# EAGLE design OPA340 (EAGLE 5.11)
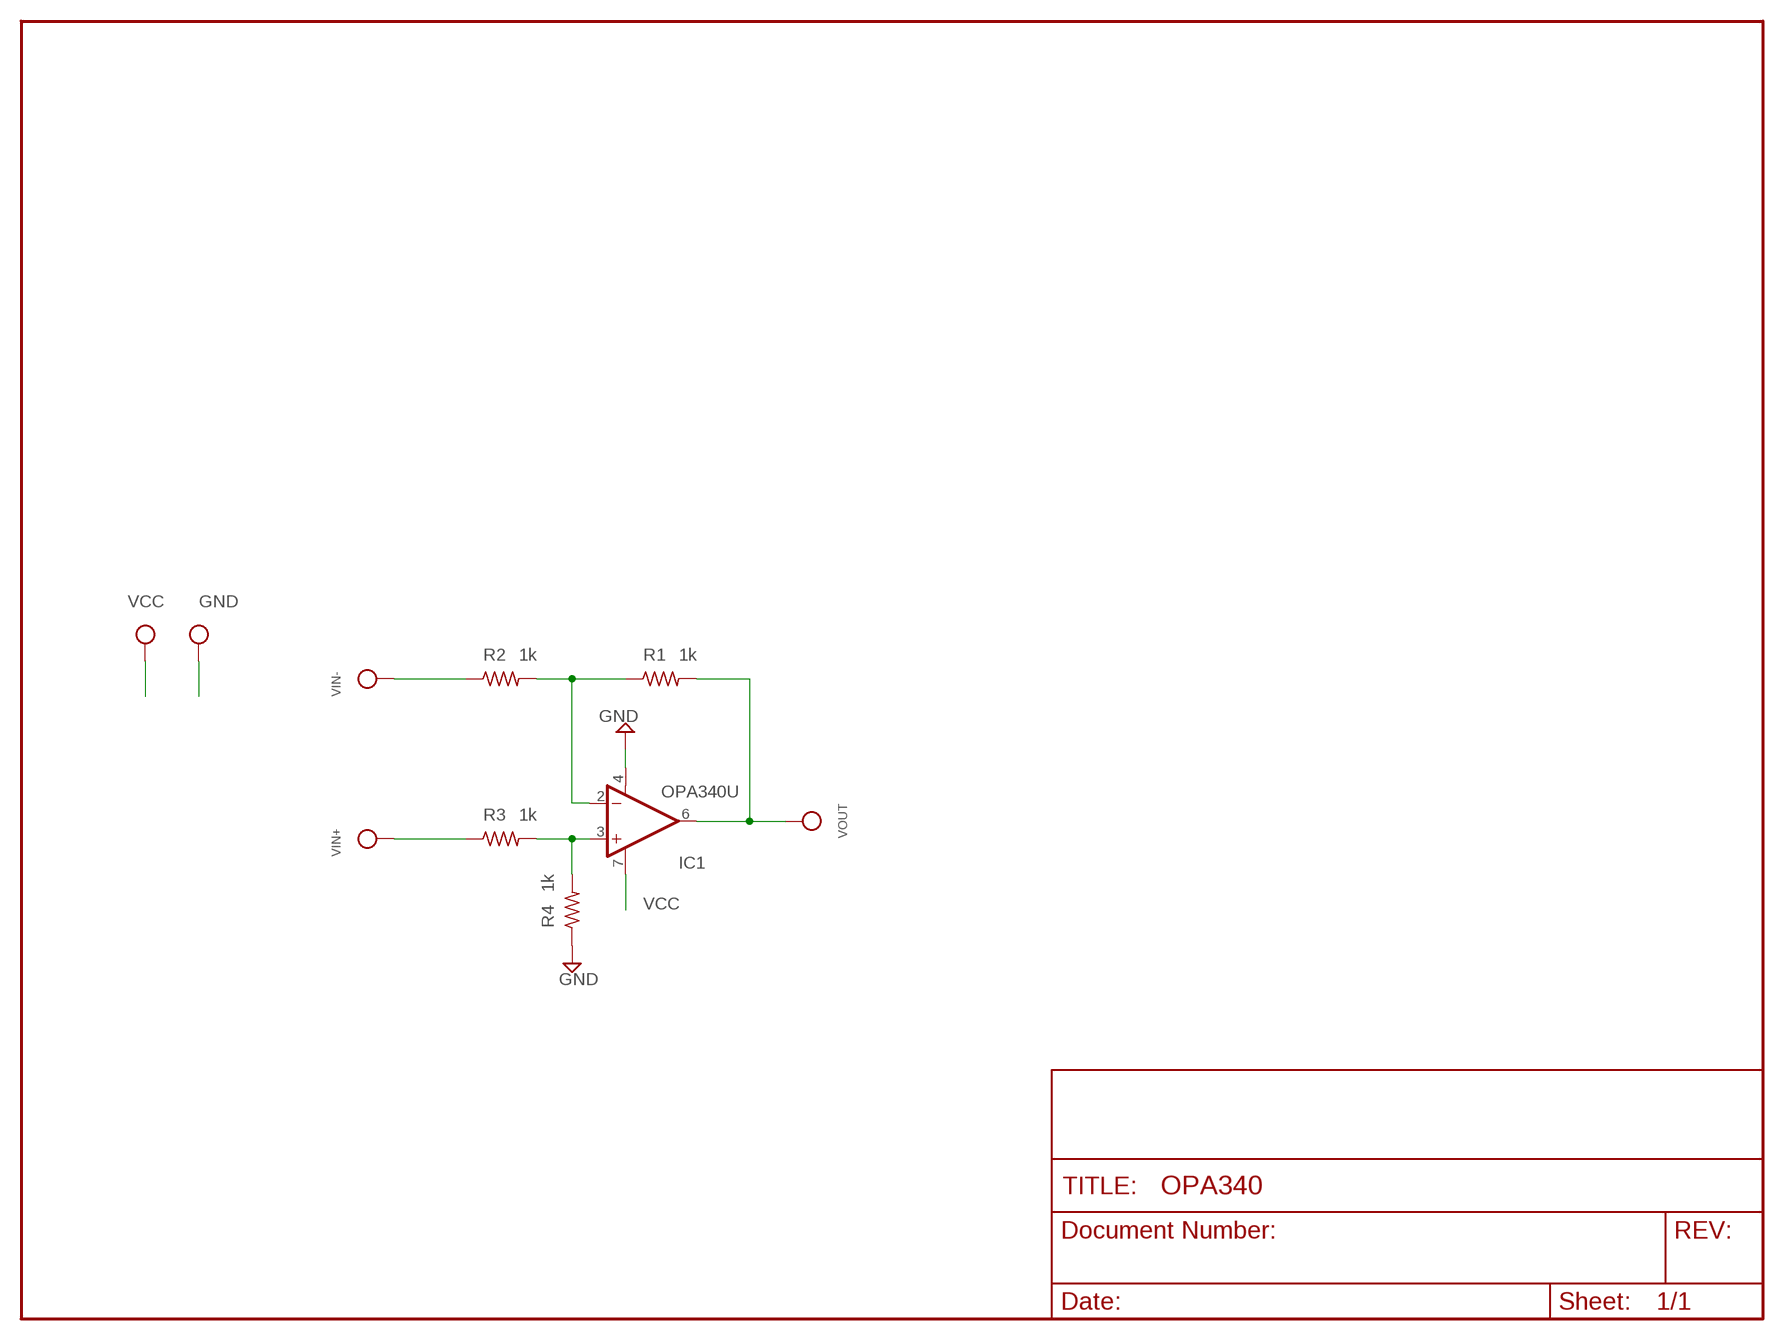
[diagram p0: schematic, sheet 1]

## Parts
IC1  OPA340U  [SO08]
R1  1k  R-US_R0805  [R0805]
R2  1k  R-US_R0805  [R0805]
R3  1k  R-US_R0805  [R0805]
R4  1k  R-US_R0805  [R0805]
TP1  TESTPOINTPAD  [TESTPOINT_PAD_2MM]
VCC  TESTPOINTPAD  [TESTPOINT_PAD_2MM]
VIN+  TESTPOINTPAD  [TESTPOINT_PAD_2MM]
VIN-  TESTPOINTPAD  [TESTPOINT_PAD_2MM]
VOUT  TESTPOINTPAD  [TESTPOINT_PAD_2MM]

## Nets
GND: IC1.4(V-) R4.1 TP1.P$1
N$1: R3.1 VIN+.P$1
N$2: R2.1 VIN-.P$1
N$3: IC1.2(-IN) R1.1 R2.2
N$4: IC1.3(+IN) R3.2 R4.2
N$5: IC1.6(OUT) R1.2 VOUT.P$1
VCC: IC1.7(V+) VCC.P$1

## Library data of the parts
IC1 = burr-brown:OPA340: Rail-to-Rail Operational Amplifiers Single-Supply, MicroAmplifier(TM) Series; MPN: OPA340UA; OC_FARNELL: 1106196; OC_NEWARK: 24M5449
R1-R4 = resistor:R-US_: RESISTOR, American symbol
TP1 VCC VIN+ VIN- VOUT = microbuilder:TESTPOINT: Test Point TESTPOINT_SMT - Compact Surface Mount Test Point [Digikey: 5016KTR-ND] TESTPOINT_PAD - Square Pad (2mm) TESTPOINT_SMT - Round Pad (2mm) TESTPOINT_0.1" - 0.1" Header

## Board
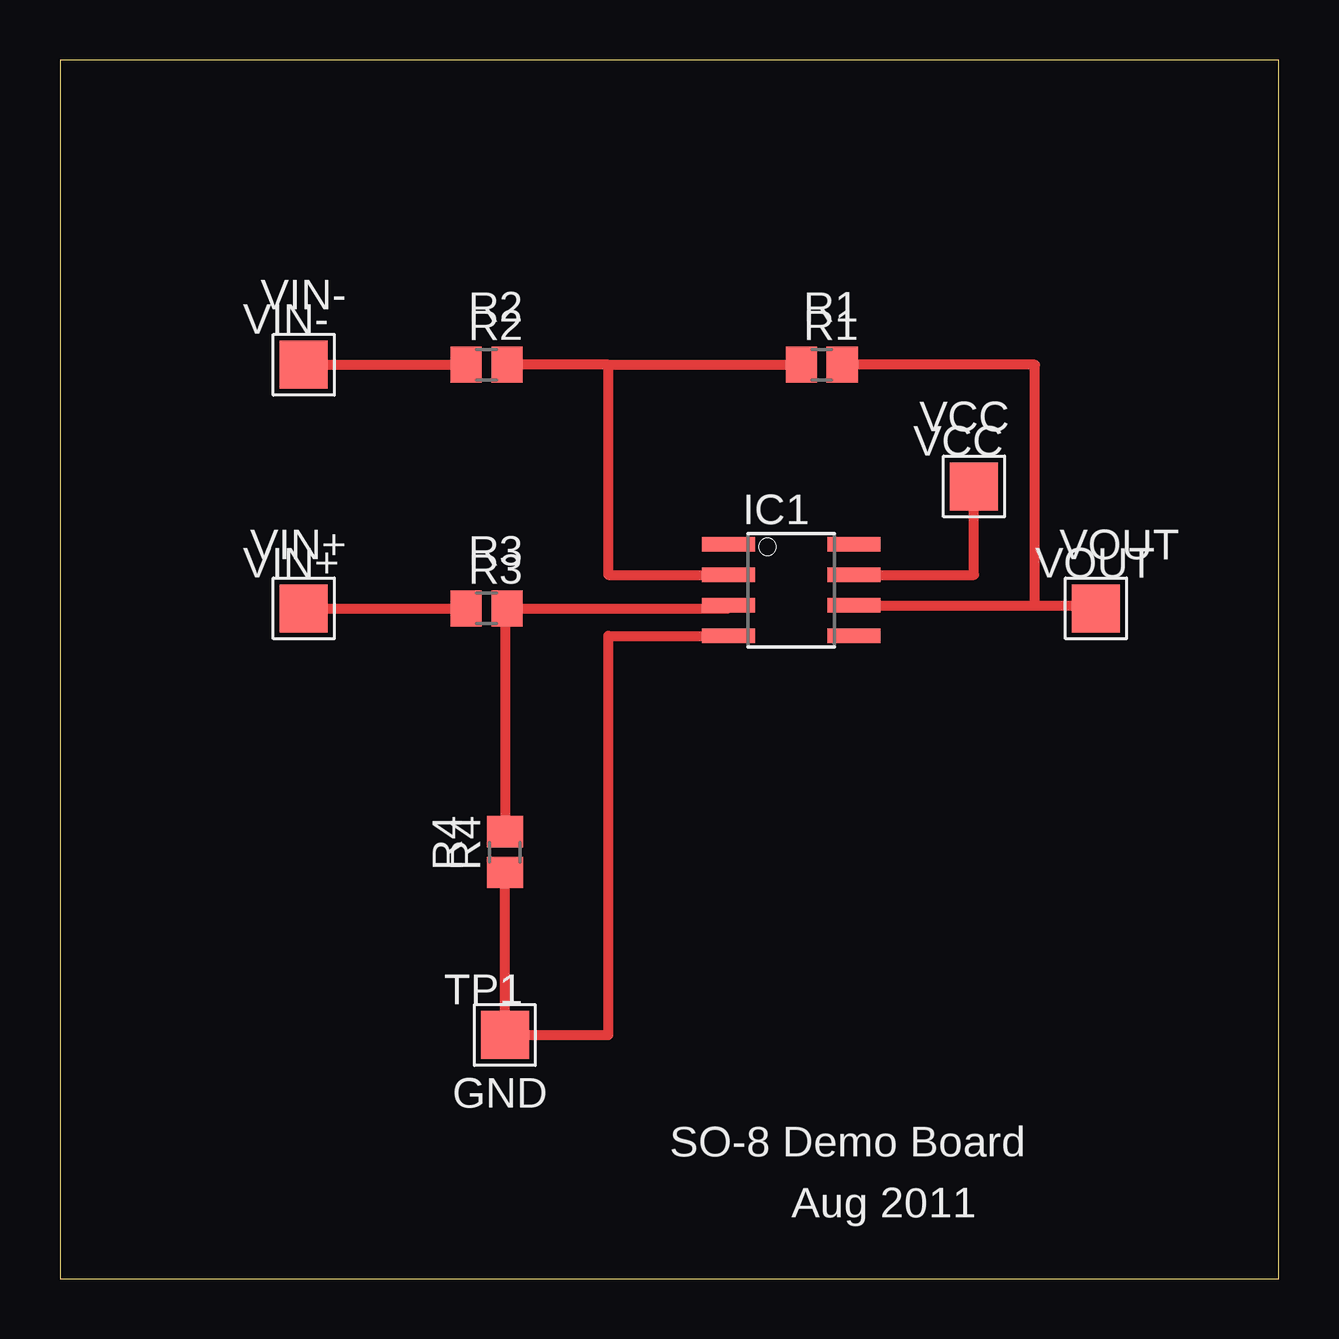
[diagram p1: board, top side]

Size 50.8 x 50.8 mm. Coordinates in mm from the lower left corner, seen from the top.
Outline: 0,0 50.8,0 50.8,50.8 0,50.8 0,0
Copper layers (1*16): Top 0.035mm / dielectric 1.5mm / Bottom 0.035mm
Design rules "default": minimum track width 10mil, minimum drill 24mil, track to track 8mil, track to pad 8mil, pad to pad 8mil, via to via 8mil, smd to smd 8mil, copper to edge 40mil, drill to drill 8mil, minimum pad ring 10mil, minimum via ring 8mil, stop-mask expansion 4mil, vias tented up to drill 0mil, thermal gap 10mil

### Footprints (pad centres in the part's own frame; a part is rotated, then mirrored left to right if it is on the bottom)
SO08 = smd 0.61 x 2.21: 1 -1.905,-2.616; 2 -0.635,-2.616; 3 0.635,-2.616; 4 1.905,-2.616; 5 1.905,2.616; 6 0.635,2.616; 7 -0.635,2.616; 8 -1.905,2.616
R0805 = smd 1.3 x 1.5: 1 -0.85,0; 2 0.85,0
TESTPOINT_PAD_2MM = smd 2 x 2: P$1 0,0

### Placement (x,y rotation side)
IC1  30.48,28.7 270 top
R1  31.75,38.1 0 top
R2  17.78,38.1 0 top
R3  17.78,27.94 0 top
R4  18.54,17.78 90 top
TP1  18.54,10.16 0 top
VCC  38.1,33.02 0 top
VIN+  10.16,27.94 0 top
VIN-  10.16,38.1 0 top
VOUT  43.18,27.94 0 top

### Tracks (layer width: path | path; a pad name or v marks a point on that pad's centre or on a via)
GND
  Top 0.406: R4.1 TP1.P$1 22.86,10.16 22.86,26.8 IC1.4
N$1
  Top 0.406: VIN+.P$1 R3.1
N$2
  Top 0.406: VIN-.P$1 R2.1
N$3
  Top 0.406: 22.86,38.1 R2.2 | 22.86,38.1 R1.1 | IC1.2 22.86,29.34 22.86,38.1
N$4
  Top 0.406: IC1.3 27.86,27.94 R3.2 18.54,27.94 R4.2
N$5
  Top 0.406: IC1.6 40.64,28.07 | 40.64,28.07 43.18,28.07 VOUT.P$1 | R1.2 40.64,38.1 40.64,28.07
VCC
  Top 0.406: IC1.7 38.1,29.34 VCC.P$1

### Text on the board
tPlace: VIN- | R2 | R1 | VCC | VIN+ | R3 | VOUT | R4 | GND | SO-8 Demo Board | Aug 2011